# Altium schematic sheet Controller.SchDoc
size A2; SheetNumber: 1; SheetTotal: 3
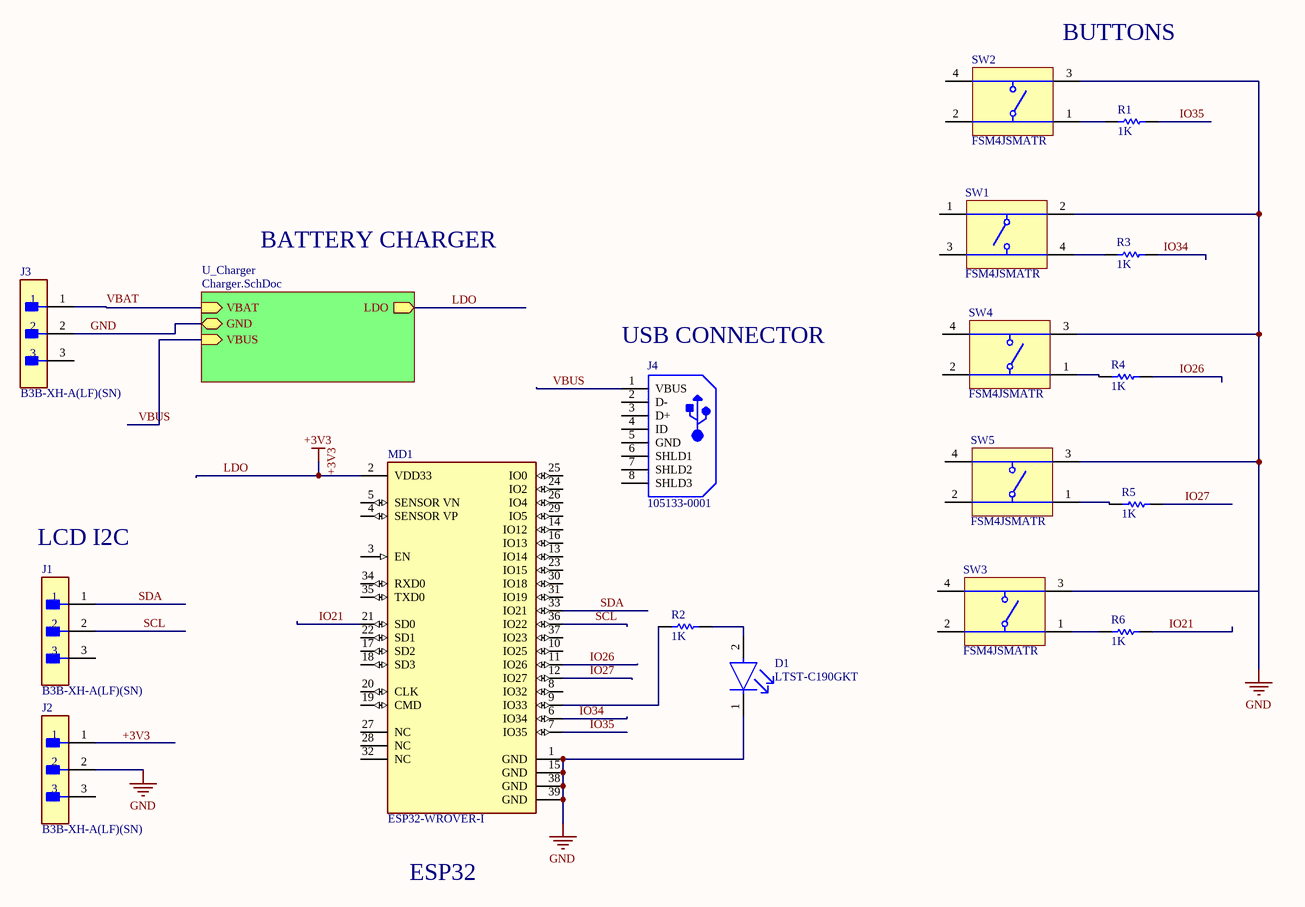
[diagram p0: Controller.SchDoc]

## Parts
D1  LTST-C190GKT  [FP-LTST-C190GKT-MFG]
J1  B3B-XH-A(LF)(SN)  [FP-B3B-XH-A_LF_SN-MFG]
J2  B3B-XH-A(LF)(SN)  [FP-B3B-XH-A_LF_SN-MFG]
J3  B3B-XH-A(LF)(SN)  [FP-B3B-XH-A_LF_SN-MFG]
J4  105133-0001  [MOLX-105133-0001_V]
MD1  ESP32-WROVER-I  [FP-ESP32-WROVER-I-MFG]
R1  1K  [RESC2013X65X40LL15T20]
R2  1K  [RESC2013X65X40LL15T20]
R3  1K  [RESC2013X65X40LL15T20]
R4  1K  [RESC2013X65X40LL15T20]
R5  1K  [RESC2013X65X40LL15T20]
R6  1K  [RESC2013X65X40LL15T20]
SW1  FSM4JSMATR  [TECO-FSM4JSMATR_V]
SW2  FSM4JSMATR  [TECO-FSM4JSMATR_V]
SW3  FSM4JSMATR  [TECO-FSM4JSMATR_V]
SW4  FSM4JSMATR  [TECO-FSM4JSMATR_V]
SW5  FSM4JSMATR  [TECO-FSM4JSMATR_V]

## Sub-sheets
U_Charger = Charger.SchDoc: VBAT (in), LDO (out), GND (bidir), VBUS (in)

## Nets
+3V3: MD1.2(VDD33) ; sheet U_Charger/LDO  [also labelled LDO]
GND: D1.1(C) J2.2 J3.2 MD1.1(GND) MD1.15(GND) MD1.38(GND) MD1.39(GND) SW1.2 SW2.3 SW4.3 SW5.3 ; sheet U_Charger/GND
IO21: MD1.21(SD0) R6.1
IO26: MD1.11(IO26) R4.1
IO27: MD1.12(IO27) R5.1
IO34: MD1.6(IO34) R3.1
IO35: MD1.7(IO35) R1.1
SCL: J1.2 MD1.36(IO22)
SDA: J1.1 MD1.33(IO21)
VBAT: J3.1 ; sheet U_Charger/VBAT
VBUS: J4.1(VBUS) ; sheet U_Charger/VBUS
NetD1_2: D1.2(A) R2.2
NetMD1_9: MD1.9(IO33) R2.1
NetR1_2: R1.2 SW2.1
NetR3_2: R3.2 SW1.4
NetR4_2: R4.2 SW4.1
NetR5_2: R5.2 SW5.1
NetR6_2: R6.2 SW3.1

Not connected (* = marked no-connect by the designer): J1 3; J2 1 3; J3 3; J4 2(D-) 3(D+) 4(ID) 5(GND) 6(SHLD1) 7(SHLD2) 8(SHLD3); MD1 3(EN) 4(SENSOR_VP) 5(SENSOR_VN) 8(IO32) 10(IO25) 13(IO14) 14(IO12) 16(IO13) 17(SD2) 18(SD3) 19(CMD) 20(CLK) 22(SD1) 23(IO15) 24(IO2) 25(IO0) 26(IO4) 27(NC) 28(NC) 29(IO5) 30(IO18) 31(IO19) 32(NC) 34(RXD0) 35(TXD0) 37(IO23); SW1 1 3; SW2 2 4; SW3 2 3 4; SW4 2 4; SW5 2 4

## Notes on the sheet
- (near SW2) BUTTONS
- BATTERY CHARGER
- (near J4) USB CONNECTOR
- (near J1) LCD I2C
- ESP32
- Labels drawn without touching a wire or pin: +3V3

## Library data of the parts
D1 = CMP-22017-000005-2: LED GREEN CLEAR CHIP SMD; Dominant Wavelength: 569nm; Reverse Voltage: 5V; Lens Color: Colorless; Viewing Angle: 130°; Voltage: 2V; Forward Current: 30mA; Power Dissipation: 100mW; Luminous Intensity: 6mcd; Number of LEDs: 1; Forward Voltage: 2.1V; Wavelength: 565nm; Test Current: 10mA; Min Operating Temperature: -55°C; Lens Style: Clear; Mount: Surface Mount; Width: 0.8mm; Packaging: Tape and Reel; Lens Transparency: Clear; Case Code (Metric): 1608; Depth: 0.8mm; Case Code (Imperial): 0603; Case/Package: 0603; Number of Pins: 2; Max Operating Temperature: 85°C; Lead Free: Lead Free; Number of Elements: 1; Length: 1.6mm; Height: 0.8mm; Package Quantity: 1; Power Rating: 100mW; Radiation Hardening: No; Illumination Color: Green; Color: Green
J1-J3 = CMP-17439-000014-3: CONN HEADER VERT 3POS 2.5MM; Max Voltage Rating (DC): 250V; Number of Positions: 3; Current Rating: 3A; Gender: Male; Wire/Cable Gauge: 22AWG; Contact Resistance: 20mR; Insulation Resistance: 1GR; Insulation Material: Nylon; Contact Plating: Tin; Depth: 5.75mm; Contact Type: Male Pin; Max Operating Temperature: 85°C; Insulation Color: Natural; Voltage Rating (AC): 250V; Color: Natural; Connector Type: Header; Orientation: Straight; Fastening Type: Detent; Housing Color: White; Min Operating Temperature: -25°C; Termination: Solder; Voltage Rating: 250V; Series: XH; Pitch: 2.5mm; Contact Shape: Square; Number of Rows: 1; Lead Free: Lead Free; Packaging: Bulk; Mount: Through Hole; Flammability Rating: UL94 V-0; Max Voltage Rating (AC): 250V; REACH SVHC: No SVHC; Housing Material: Polyamide; Contact Material: Brass; Lead Pitch: 2.5mm; Contact Finish - Mating: TIN; Length: 9.9mm; Max Current Rating: 3A; Number of Contacts: 3
J4 = CMP-2000-05829-1: Micro-USB B Receptacle, Vertical, -30 to 85 degC, 5-Pin SMD, RoHS, Tape and Reel; Manufacturer: Molex; Package Version: Rev. C, 11/2015; Voltage Rating: 30VAC; Connector Type: MicroUSBTypeBReceptacle; Current Rating: 1.8A; Number of Ports: 1; Voltage - Max: 30V; Mounting Style: SMD/SMT; Packaging: Reel; Product: MicroUSBTypeBConnectors; Contact Plating: Gold; Flammability Rating: UL94V-0; Package Description: 5-Pin Surface Mount Device, Pitch 0.65 mm; Package Reference: 105133-0001; Contact Material: CopperAlloy; Mounting Angle: Vertical; RoHS: Details; Manufacturer URL: http://www.molex.com/; Factory Pack Quantity: 6000; PartNumber: 105133-0001; Standard: USB; Brand: Molex; Series: 105133; Product Category: USBConnectors; Termination Style: SolderTail; Gender: Receptacle; Package URL: http://www.molex.com/pdm_docs/sd/1051330001_sd.pdf; Datasheet Version: 03/2016; Color: Black; Datasheet URL: http://www.molex.com/webdocs/datasheets/pdf/en-us/1051330001_IO_CONNECTORS.pdf; Mounting Technology: SurfaceMount
MD1 = CMP-194065-000001-1: SMD MODULE, ESP32-D0WDQ6, 32MBIT; Manufacturer: Espressif; Number Of Adc Channels: 16; Min Supply Voltage: 2.3V; Interface: I2C,SPI,UART,I2S,Other; Max Frequency: 2484MHz; Nominal Supply Current: 500mA; Sensitivity: -98dBm; Max Supply Voltage: 3.6V; Number Of Gpio: 20; Data Rate: 150Mbits/s; Package: ESP32-WROVER-I; Temperature Range Low: -40°C; Temperature Range High: +85°C; Device Class L1: Integrated Circuits (ICs); Category: UNK; ComponentLink2Description: Datasheet; Device Class L2: RF Semiconductors and Devices; Automotive: No; Lead Free: Yes; Octopart: https://octopart.com/esp32-wrover-i-espressif+systems-89171349; ComponentLink2URL: https://www.espressif.com/sites/default/files/documentation/esp32-wrover_datasheet_en.pdf; Temperature: -40°C to +85°C; Height: 3.4mm; RoHS: TRUE; Digikey Description: SMD MODULE, ESP32-D0WDQ6, 32MBIT; Device Class L3: Transceivers; Manufacturer Part Number: ESP32-WROVER-I
R1-R6 = CMP-2000-07514-1: Chip Resistor, 0 Ohm, 0.125 W, -55 to 125 degC, 0805 (2012 Metric), RoHS, Tape and Reel; Manufacturer: TE Connectivity; Power Rating: 125mW; Voltage Rating: 150V; Tolerance: 0%; Case\/Package: 0805; Number of Resistors: 1; Resistance: 0mOhm; Datasheet URL: www.te.com/commerce/DocumentDelivery/DDEController?Action=showdoc&DocId=Customer+Drawing%7F1623401%7FBA%7Fpdf%7FEnglish%7FENG_CD_1623401_BA.pdf%7F1623401-1; Composition: ThickFilm; Max Operating Temperature: 125degC; Min Operating Temperature: -55degC; ELV: Compliant; Case Code (Metric): 2012; Number of Terminations: 2; Weight: 0.000194oz; Length: 2mm; Mount: SurfaceMount; Packaging: TapeandReel; Case Code (Imperial): 0805; RoHSCompliant: true; Width: 1.25mm; Radiation Hardening: No; Termination: Solder; Manufacturer URL: http://www.te.com/; Package Description: 2-Pin Surface Mount Device, Body 2 x 1.25 mm; Mounting Technology: SurfaceMount; Height: 0.55mm; Package Quantity: 5000; Package Reference: RESC2013X65X40L15T20; Datasheet Version: Rev. BA, 12/2009; Depth: 1.25mm
SW1-SW5 = CMP-2000-07486-1: Micro Miniature Push Button Switch FSM JSM, 50 mA, -35 to 85 degC, 4-Pin SMD, RoHS, Tape and Reel; Manufacturer: TE Connectivity; Mechanical Life: 100000Cycles; Current Rating: 50mA; Actuator Material: Polyamide; Max Voltage Rating (DC): 12V; Capacitance: 0f; Illumination Type: Illuminated; Voltage Rating (DC): 24V; Case\/Package: SMD/SMT; Operating Force: 160gf; Contact Resistance: 100mOhm; Actuator Length: 0.055inch; Switch Travel: 0.25mm; Throw Configuration: SPST; Termination: GullWing; Contact Plating: Silver; Orientation: Straight; Mounting Technology: SurfaceMount; REACH SVHC: Unknown; Electrical Life: 100000Cycles; Package Reference: FSM4JSMATR; Max Operating Temperature: 85degC; Manufacturer URL: http://www.te.com/; Package Description: 4-Pin Surface Mount Device, Body 6 x 6 mm, Pitch 4.5 mm; Datasheet Version: Rev. V, 02/2015; Packaging: TapeandReel; Min Operating Temperature: -35degC; Mount: SurfaceMount; Contact Current Rating: 50mA; Contact Material: CopperAlloy; Package Quantity: 1200; Datasheet URL: http://www.te.com/commerce/DocumentDelivery/DDEController?Action=showdoc&DocId=Customer+Drawing%7F2-1437565-7%7FV%7Fpdf%7FEnglish%7FENG_CD_2-1437565-7_V.pdf%7F4-1437565-2; RoHSCompliant: true